# EAGLE design M785dec (EAGLE 6.6.0)
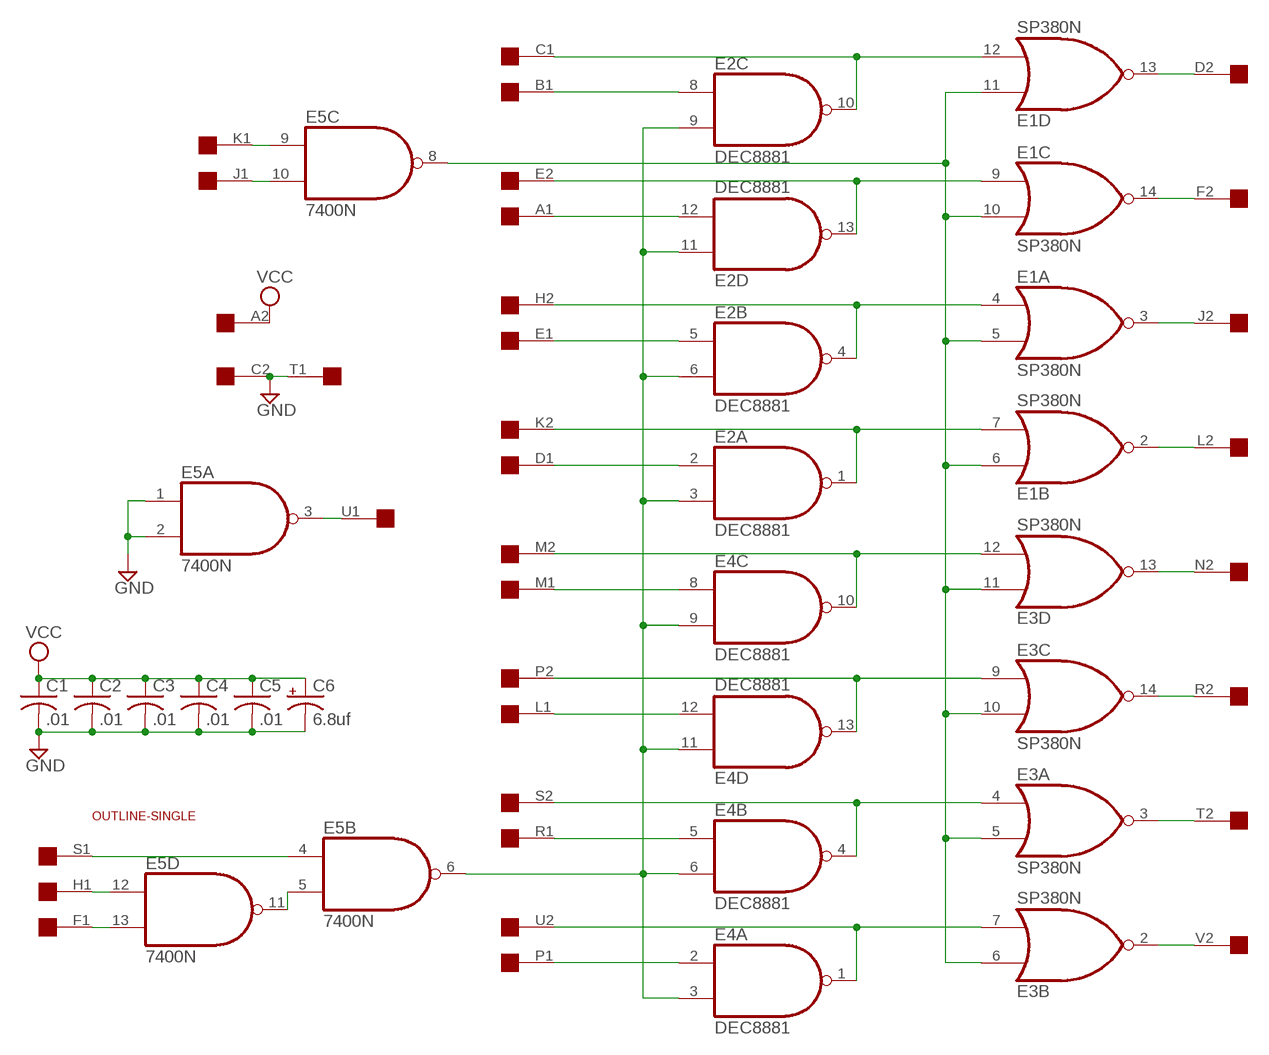
[diagram p0: schematic, sheet 1]

## Parts
C1  .01  C-US050-025X075  [C050-025X075]
C2  .01  C-US050-025X075  [C050-025X075]
C3  .01  C-US050-025X075  [C050-025X075]
C4  .01  C-US050-025X075  [C050-025X075]
C5  .01  C-US050-025X075  [C050-025X075]
C6  6.8uf  CPOL-USE15-5AXIAL  [E15-5]
E1  SP380N  [DIL14]
E2  DEC8881  N8881N  [DIL14]
E3  SP380N  [DIL14]
E4  DEC8881  N8881N  [DIL14]
E5  7400N  [DIL14]
U$1  SINGLE  [EDGE-CON2]
U$2  OUTLINE-SINGLE  [SINGLE]

## Nets
GND: C1.2 C2.2 C3.2 C4.2 C5.2 C6.- E5.1(A:I0) E5.2(A:I1) U$1.C2 U$1.T1
N$1: E1.5(A:I1) E1.6(B:I0) E1.10(C:I1) E1.11(D:I0) E3.5(A:I1) E3.6(B:I0) E3.10(C:I1) E3.11(D:I0) E5.8(C:O)
N$2: E2.3(A:I1) E2.6(B:I1) E2.9(C:I1) E2.11(D:I0) E4.3(A:I1) E4.6(B:I1) E4.9(C:I1) E4.11(D:I0) E5.6(B:O)
N$3: E3.12(D:I1) E4.10(C:O) U$1.M2
N$4: E3.7(B:I1) E4.1(A:O) U$1.U2
N$5: E4.2(A:I0) U$1.P1
N$6: E4.5(B:I0) U$1.R1
N$7: E3.4(A:I0) E4.4(B:O) U$1.S2
N$8: E4.12(D:I1) U$1.L1
N$9: E3.9(C:I0) E4.13(D:O) U$1.P2
N$10: E4.8(C:I0) U$1.M1
N$11: E1.12(D:I1) E2.10(C:O) U$1.C1
N$12: E2.8(C:I0) U$1.B1
N$13: E1.9(C:I0) E2.13(D:O) U$1.E2
N$14: E2.12(D:I1) U$1.A1
N$15: E1.4(A:I0) E2.4(B:O) U$1.H2
N$16: E2.5(B:I0) U$1.E1
N$17: E1.7(B:I1) E2.1(A:O) U$1.K2
N$18: E2.2(A:I0) U$1.D1
N$19: E5.9(C:I0) U$1.K1
N$20: E5.10(C:I1) U$1.J1
N$21: E1.13(D:O) U$1.D2
N$22: E1.14(C:O) U$1.F2
N$23: E1.3(A:O) U$1.J2
N$24: E1.2(B:O) U$1.L2
N$25: E3.13(D:O) U$1.N2
N$26: E3.14(C:O) U$1.R2
N$27: E3.3(A:O) U$1.T2
N$28: E3.2(B:O) U$1.V2
N$29: E5.4(B:I0) U$1.S1
N$30: E5.5(B:I1) E5.11(D:O)
N$31: E5.12(D:I0) U$1.H1
N$32: E5.13(D:I1) U$1.F1
N$33: E5.3(A:O) U$1.U1
VCC: C1.1 C2.1 C3.1 C4.1 C5.1 C6.+ U$1.A2
Unconnected: U$1.B2 U$1.N1 U$1.V1

## Power pins joined to a net without a drawn wire
GND: E1.1(P:GND) E2.7(P:GND) E3.1(P:GND) E4.7(P:GND) E5.7(P:GND)
VCC: E1.8(P:VCC) E2.14(P:VCC) E3.8(P:VCC) E4.14(P:VCC) E5.14(P:VCC)

## Library data of the parts
C1-C5 = rcl:C-US: CAPACITOR, American symbol
C6 = rcl:CPOL-US: POLARIZED CAPACITOR, American symbol
E1 E3 = dec-con:SP380: Quad NOR gate (use 8640)
E2 E4 = dec-con:N8881: Quad 2-input NAND gate, open collector
E5 = 74xx-us:74*00: Quad 2-input NAND gate
U$1 = dec-con:SINGLE: Single-Height DEC board
U$2 = dec-con:OUTLINE-*: Board outlines for DEC boards.

## Board
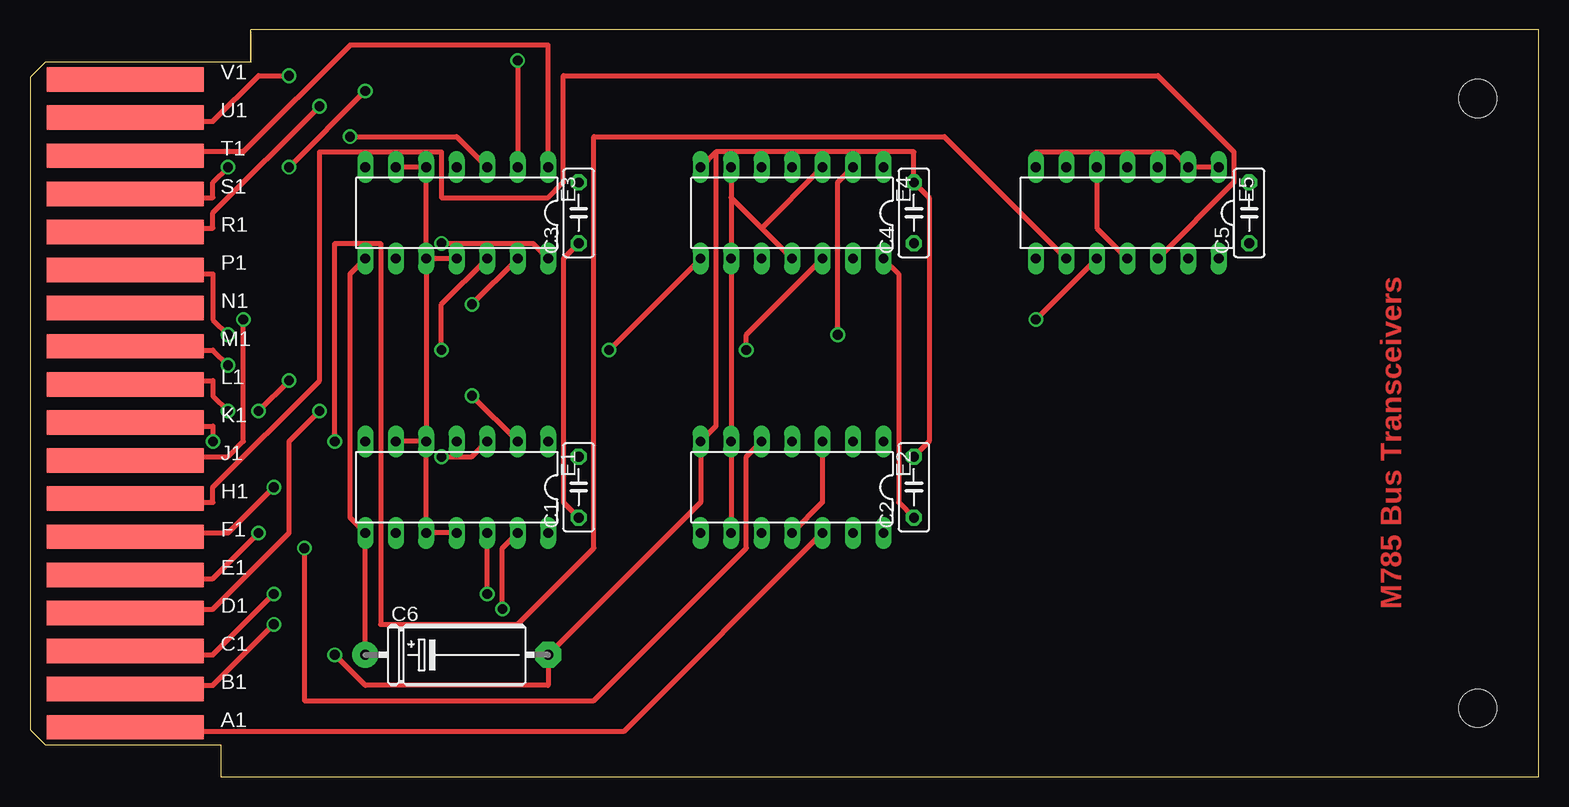
[diagram p1: board, top side]
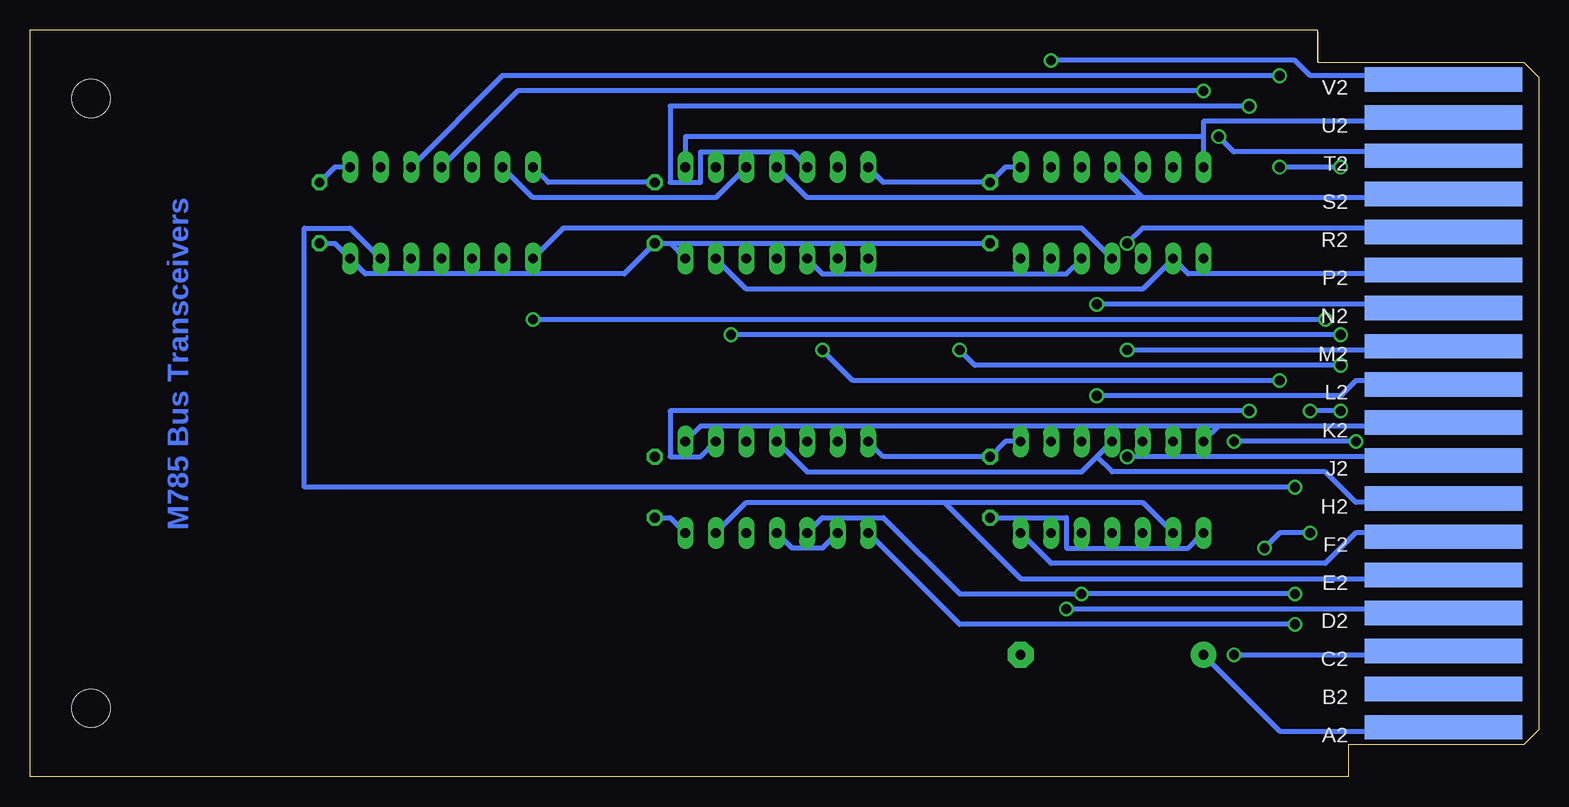
[diagram p2: board, bottom side, seen from below]

Size 125.73 x 62.23 mm. Coordinates in mm from the lower left corner, seen from the top.
Copper layers (1+16): Top 0.035mm / dielectric 1.5mm / Bottom 0.035mm
Design rules "16mils": minimum track width 16mil, minimum drill 32mil, track to track 15mil, track to pad 10mil, pad to pad 10mil, via to via 10mil, smd to smd 10mil, copper to edge 13mil, drill to drill 10mil, minimum pad ring 10mil, minimum via ring 8mil, stop-mask expansion 0mil, vias tented up to drill 0mil, thermal gap 10mil

### Footprints (pad centres in the part's own frame; a part is rotated, then mirrored left to right if it is on the bottom)
C050-025X075 = drill 0.813 octagon: 1 -2.54,0; 2 2.54,0
E15-5 = drill 0.813 pad 2.159: + -7.62,0 | drill 0.813 pad 2.159 octagon: - 7.62,0
DIL14 = drill 0.813 long: 1 -7.62,-3.81; 2 -5.08,-3.81; 3 -2.54,-3.81; 4 0,-3.81; 5 2.54,-3.81; 6 5.08,-3.81; 7 7.62,-3.81; 8 7.62,3.81; 9 5.08,3.81; 10 2.54,3.81; 11 0,3.81; 12 -2.54,3.81; 13 -5.08,3.81; 14 -7.62,3.81
EDGE-CON2 = smd 13.106 x 2.032: A1 7.938,4.128; B1 7.938,7.303; C1 7.938,10.477; D1 7.938,13.652; E1 7.938,16.828; F1 7.938,20.003; H1 7.938,23.177; J1 7.938,26.352; K1 7.938,29.527; L1 7.938,32.703; M1 7.938,35.877; N1 7.938,39.053; P1 7.938,42.227; R1 7.938,45.403; S1 7.938,48.578; T1 7.938,51.752; U1 7.938,54.928; V1 7.938,58.102 | smd 13.106 x 2.032 bottom: A2 7.938,4.128; B2 7.938,7.303; C2 7.938,10.477; D2 7.938,13.652; E2 7.938,16.828; F2 7.938,20.003; H2 7.938,23.177; J2 7.938,26.352; K2 7.938,29.527; L2 7.938,32.703; M2 7.938,35.877; N2 7.938,39.053; P2 7.938,42.227; R2 7.938,45.403; S2 7.938,48.578; T2 7.938,51.752; U2 7.938,54.928; V2 7.938,58.102
SINGLE = hole 3.175: 120.65,56.515; 120.65,5.715

### Placement (x,y rotation side)
C1  45.72,24.13 90 top
C2  73.66,24.13 90 top
C3  45.72,46.99 90 top
C4  73.66,46.99 90 top
C5  101.6,46.99 90 top
C6  35.56,10.16 0 top
E1  35.56,24.13 180 top
E2  63.5,24.13 180 top
E3  35.56,46.99 180 top
E4  63.5,46.99 180 top
E5  91.44,46.99 180 top
U$1  0,0 0 top
U$2  0,0 0 top

### Tracks (layer width: path | path; a pad name or v marks a point on that pad's centre or on a via)
GND  (via drill 0.81)
  Top 0.406: v25.4,10.16 27.94,7.62 43.18,7.62 C6.- 55.88,22.86 E2.7 57.15,29.21 57.15,52.07 | E5.1 E5.2 95.25,52.07 83.82,52.07 E5.7 | C2.2 74.93,27.94 74.93,48.26 C4.2 73.66,52.07 57.15,52.07 | 57.15,52.07 E4.7 | E3.1 43.18,60.96 26.67,60.96 17.78,52.07 8.89,52.07 U$1.T1
  Bottom 0.406: E1.1 44.45,27.94 C1.2 54.61,26.67 E2.7 | v25.4,10.16 8.89,10.16 U$1.C2 | E3.1 44.45,50.8 C3.2 54.61,49.53 E4.7 | C5.2 100.33,50.8 E5.1 | E5.7 82.55,49.53 C4.2
N$1
  Top 0.406: E1.5 E1.6 | E1.11 E1.10 E1.5 | E3.6 E3.5 E3.10 | E3.11 E3.10 | E3.10 E1.5
  Bottom 0.406: E5.8 81.28,45.72 38.1,45.72 E3.11
N$2
  Top 0.406: E2.11 66.04,22.86 E2.3 | E2.9 E2.6 E4.9 58.42,48.26 | E4.6 58.42,48.26 | 58.42,48.26 60.96,45.72 | 60.96,45.72 E4.11 | 60.96,45.72 E4.3
  Bottom 0.406: E5.6 83.82,48.26 68.58,48.26 E4.3 | E2.11 62.23,19.05 59.69,19.05 E2.9
N$3  (via drill 0.81)
  Top 0.406: E3.12 34.29,39.37 v34.29,35.56
  Bottom 0.406: E3.12 39.37,41.91 59.69,41.91 E4.10 | v34.29,35.56 8.89,35.56 U$1.M2
N$4
  Bottom 0.406: 27.94,53.34 27.94,54.61 8.89,54.61 U$1.U2 | 27.94,53.34 E3.7 | E4.1 71.12,53.34 27.94,53.34
N$5  (via drill 0.81)
  Top 0.406: E4.2 67.31,49.53 v67.31,36.83 | v16.51,36.83 15.24,38.1 15.24,41.91 8.89,41.91 U$1.P1
  Bottom 0.406: v16.51,36.83 v67.31,36.83
N$6  (via drill 0.81)
  Top 0.406: v24.13,55.88 15.24,46.99 15.24,45.72 8.89,45.72 U$1.R1
  Bottom 0.406: E4.5 62.23,52.07 69.85,52.07 69.85,49.53 72.39,49.53 72.39,55.88 v24.13,55.88
N$7
  Bottom 0.406: 33.02,48.26 E3.4 | 33.02,48.26 8.89,48.26 U$1.S2 | E4.4 60.96,48.26 33.02,48.26
N$8  (via drill 0.81)
  Top 0.406: E4.12 59.69,36.83 v59.69,35.56 | v19.05,30.48 v21.59,33.02 | v16.51,30.48 15.24,31.75 15.24,33.02 8.89,33.02 U$1.L1
  Bottom 0.406: v59.69,35.56 57.15,33.02 v21.59,33.02 | v16.51,30.48 v19.05,30.48
N$9
  Bottom 0.406: U$1.P2 8.89,41.91 29.21,41.91 E3.9 33.02,40.64 66.04,40.64 E4.13
N$10  (via drill 0.81)
  Top 0.406: v48.26,35.56 E4.8 | v16.51,34.29 15.24,35.56 8.89,35.56 U$1.M1
  Bottom 0.406: v48.26,35.56 46.99,34.29 v16.51,34.29
N$11  (via drill 0.81)
  Top 0.406: v38.1,15.24 E1.12 | v20.32,15.24 15.24,10.16 8.89,10.16 U$1.C1
  Bottom 0.406: E2.10 59.69,21.59 54.61,21.59 48.26,15.24 v38.1,15.24 v20.32,15.24
N$12  (via drill 0.81)
  Top 0.406: v20.32,12.7 15.24,7.62 8.89,7.62 U$1.B1
  Bottom 0.406: E2.8 48.26,12.7 v20.32,12.7
N$13
  Bottom 0.406: E1.9 33.02,22.86 49.53,22.86 | 49.53,22.86 66.04,22.86 E2.13 | 49.53,22.86 43.18,16.51 8.89,16.51 U$1.E2
N$14
  Top 0.406: E2.12 49.53,3.81 8.89,3.81 U$1.A1
N$15
  Bottom 0.406: 36.83,26.67 38.1,25.4 60.96,25.4 E2.4 | 36.83,26.67 E1.4 | 36.83,26.67 35.56,25.4 17.78,25.4 15.24,22.86 8.89,22.86 U$1.H2
N$16  (via drill 0.81)
  Top 0.406: E2.5 59.69,26.67 59.69,19.05 46.99,6.35 22.86,6.35 v22.86,19.05 | v19.05,20.32 15.24,16.51 8.89,16.51 U$1.E1
  Bottom 0.406: v22.86,19.05 21.59,20.32 v19.05,20.32
N$17
  Bottom 0.406: 26.67,29.21 E1.7 | 26.67,29.21 8.89,29.21 U$1.K2 | E2.1 69.85,29.21 26.67,29.21
N$18  (via drill 0.81)
  Top 0.406: v24.13,30.48 21.59,27.94 21.59,20.32 15.24,13.97 8.89,13.97 U$1.D1
  Bottom 0.406: E2.2 69.85,26.67 72.39,26.67 72.39,30.48 v24.13,30.48
N$19  (via drill 0.81)
  Top 0.406: E5.9 76.2,53.34 46.99,53.34 46.99,19.05 40.64,12.7 29.21,12.7 29.21,44.45 25.4,44.45 v25.4,27.94 | v15.24,27.94 15.24,29.21 8.89,29.21 U$1.K1
  Bottom 0.406: v15.24,27.94 v25.4,27.94
N$20  (via drill 0.81)
  Top 0.406: v83.82,38.1 E5.10 | v17.78,38.1 17.78,27.94 16.51,26.67 8.89,26.67 U$1.J1
  Bottom 0.406: v17.78,38.1 v83.82,38.1
N$21  (via drill 0.81)
  Top 0.406: E1.13 39.37,19.05 v39.37,13.97
  Bottom 0.406: v39.37,13.97 8.89,13.97 U$1.D2
N$22
  Bottom 0.406: E1.14 40.64,17.78 17.78,17.78 15.24,20.32 8.89,20.32 U$1.F2
N$23  (via drill 0.81)
  Top 0.406: E1.3 36.83,26.67 v34.29,26.67
  Bottom 0.406: v34.29,26.67 8.89,26.67 U$1.J2
N$24  (via drill 0.81)
  Top 0.406: v36.83,31.75 E1.2
  Bottom 0.406: v36.83,31.75 16.51,31.75 15.24,33.02 8.89,33.02 U$1.L2
N$25  (via drill 0.81)
  Top 0.406: v36.83,39.37 E3.13
  Bottom 0.406: v36.83,39.37 8.89,39.37 U$1.N2
N$26  (via drill 0.81)
  Top 0.406: E3.14 41.91,44.45 v34.29,44.45
  Bottom 0.406: v34.29,44.45 33.02,45.72 8.89,45.72 U$1.R2
N$27  (via drill 0.81)
  Top 0.406: E3.3 35.56,53.34 v26.67,53.34
  Bottom 0.406: v26.67,53.34 25.4,52.07 8.89,52.07 U$1.T2
N$28  (via drill 0.81)
  Top 0.406: v40.64,59.69 E3.2
  Bottom 0.406: v40.64,59.69 20.32,59.69 19.05,58.42 8.89,58.42 U$1.V2
N$29  (via drill 0.81)
  Top 0.406: v21.59,50.8 v27.94,57.15 | v16.51,50.8 15.24,49.53 15.24,48.26 8.89,48.26 U$1.S1
  Bottom 0.406: E5.4 85.09,57.15 v27.94,57.15 | v16.51,50.8 v21.59,50.8
N$30
  Top 0.406: E5.11 88.9,45.72 E5.5
N$31
  Top 0.406: E5.12 100.33,49.53 100.33,52.07 93.98,58.42 44.45,58.42 44.45,49.53 43.18,48.26 34.29,48.26 34.29,52.07 24.13,52.07 24.13,33.02 15.24,24.13 15.24,22.86 8.89,22.86 U$1.H1
N$32  (via drill 0.81)
  Top 0.406: v20.32,24.13 16.51,20.32 8.89,20.32 U$1.F1
  Bottom 0.406: E5.13 99.06,45.72 102.87,45.72 102.87,24.13 v20.32,24.13
N$33  (via drill 0.81)
  Top 0.406: v21.59,58.42 19.05,58.42 15.24,54.61 8.89,54.61 U$1.U1
  Bottom 0.406: E5.3 86.36,58.42 v21.59,58.42
VCC
  Top 0.406: C6.+ E1.8 26.67,21.59 26.67,41.91 E3.8 | C1.1 44.45,22.86 44.45,43.18 C3.1 | C2.1 72.39,22.86 72.39,41.91 E4.14
  Bottom 0.406: C6.+ 21.59,3.81 8.89,3.81 U$1.A2 | C5.1 100.33,44.45 E5.14 97.79,41.91 76.2,41.91 C4.1 72.39,44.45 | E2.14 72.39,21.59 C2.1 | 72.39,44.45 E4.14 | 72.39,44.45 C3.1 | E1.8 29.21,19.05 39.37,19.05 39.37,21.59 C1.1

### Text on the board
Top: M785 Bus Transceivers
Bottom: M785 Bus Transceivers